# EAGLE design powercast-breakout (EAGLE 7.7.0)
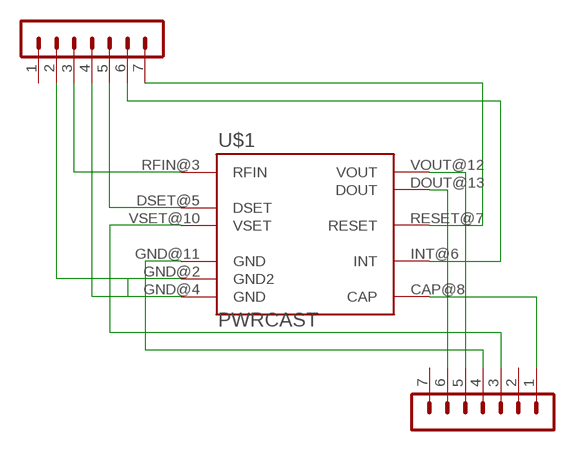
[diagram p0: schematic, sheet 1]

## Parts
S  MA07-1OCTAGON-NS  [MA07-1-SMALL-NOSILK]
SV2  MA07-1OCTAGON-NS  [MA07-1-SMALL-NOSILK]
U$1  PWRCAST  [POWERCASTRCVMOD]

## Nets
GND: S.2 S.4 U$1.GND@2(GND2) U$1.GND@4(GND)
N$1: S.3 U$1.RFIN@3(RFIN)
N$2: S.5 U$1.DSET@5(DSET)
N$5: S.7 U$1.RESET@7(RESET)
N$6: S.6 U$1.INT@6(INT)
N$7: SV2.1 U$1.CAP@8(CAP)
N$8: SV2.6 U$1.DOUT@13(DOUT)
N$9: SV2.5 U$1.VOUT@12(VOUT)
N$10: SV2.4 U$1.GND@11(GND)
N$11: SV2.3 U$1.VSET@10(VSET)
Unconnected: S.1 SV2.2 SV2.7

## Library data of the parts
S SV2 = con-lstb:MA07-1: PIN HEADER
U$1 = powercast:PWRCAST: Powercast Receiver P2110B Module

## Board
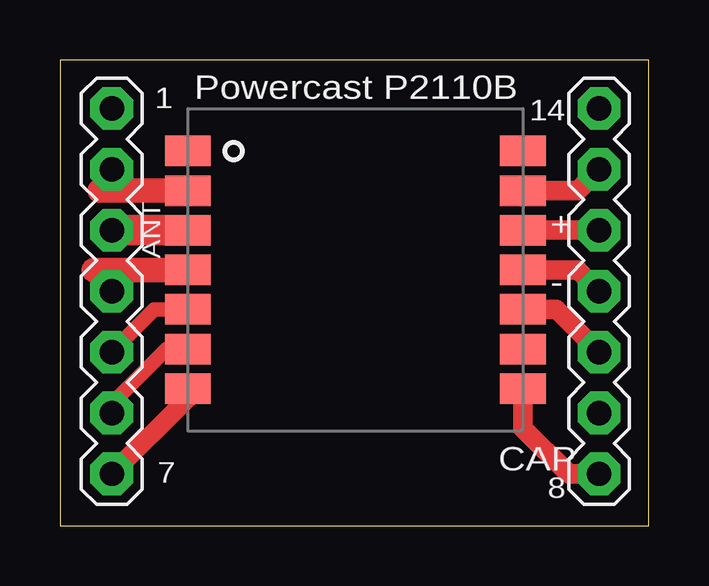
[diagram p1: board, top side]
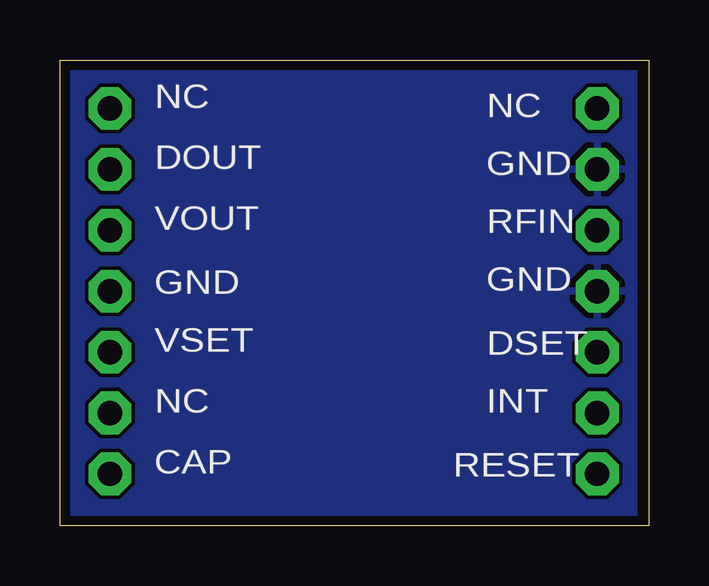
[diagram p2: board, bottom side, seen from below]

Size 24.56 x 19.42 mm. Coordinates in mm from the lower left corner, seen from the top.
Outline: 0,0 24.56,0 24.56,19.42 0,19.42 0,0
Copper layers (1*16): Top 0.0356mm / dielectric 1.5011mm / Bottom 0.0356mm
Design rules "oshpark-2layer *": minimum track width 6mil, minimum drill 13mil, track to track 6mil, track to pad 6mil, pad to pad 6mil, via to via 6mil, smd to smd 6mil, copper to edge 16mil, drill to drill 6mil, minimum pad ring 7mil, minimum via ring 7mil, stop-mask expansion 2.5mil, vias tented up to drill 0mil, thermal gap 10mil

### Footprints (pad centres in the part's own frame; a part is rotated, then mirrored left to right if it is on the bottom)
MA07-1-SMALL-NOSILK = drill 1.016 pad 1.778 octagon: 1 -7.62,0; 2 -5.08,0; 3 -2.54,0; 4 0,0; 5 2.54,0; 6 5.08,0; 7 7.62,0
POWERCASTRCVMOD = smd 1.905 x 1.27: CAP@8 6.985,-4.953; DOUT@13 6.985,3.302; DSET@5 -6.985,-1.651; GND@2 -6.985,3.302; GND@4 -6.985,0; GND@11 6.985,0; INT@6 -6.985,-3.302; NC@1 -6.985,4.953; NC@9 6.985,-3.302; NC@14 6.985,4.953; RESET@7 -6.985,-4.953; RFIN@3 -6.985,1.651; VOUT@12 6.985,1.651; VSET@10 6.985,-1.651

### Placement (x,y rotation side)
S  2.16,9.78 270 top
SV2  22.48,9.78 90 top
U$1  12.32,10.67 0 top

### Tracks (layer width: path | path; a pad name or v marks a point on that pad's centre or on a via)
GND
  Top 1.016: U$1.GND@2 2.16,13.97 | 2.16,13.97 1.65,13.97 | S.2 2.16,13.97 | U$1.GND@4 2.16,10.67 | 2.16,10.67 1.4,10.67 | S.4 2.16,10.67
  pour Bottom: 0.64,0.25 24,0.25 24,18.92 0.64,18.92
N$1
  Top 1.27: U$1.RFIN@3 S.3
N$2
  Top 0.61: U$1.DSET@5 3.94,9.02 S.5
N$5  (1 unrouted)
  Top 0.813: 5.33,5.33 S.7
N$6
  Top 0.61: U$1.INT@6 4.45,7.37 2.16,5.08 S.6
N$7
  Top 0.813: U$1.CAP@8 19.3,4.06 21.21,2.16 SV2.1
N$8
  Top 0.813: U$1.DOUT@13 21.59,13.97 SV2.6
N$9
  Top 0.813: U$1.VOUT@12 SV2.5
N$10
  Top 0.813: U$1.GND@11 21.59,10.67 SV2.4
N$11
  Top 0.813: U$1.VSET@10 20.7,9.02 SV2.3

### Text on the board
tPlace: Powercast P2110B | 1 | 14 | ANT | + | - | 7 | CAP | 8
bPlace: NC | NC | GND | DOUT | RFIN | VOUT | GND | GND | DSET | VSET | INT | NC | RESET | CAP